# EAGLE schematic minesweeper (EAGLE 7.4.0)
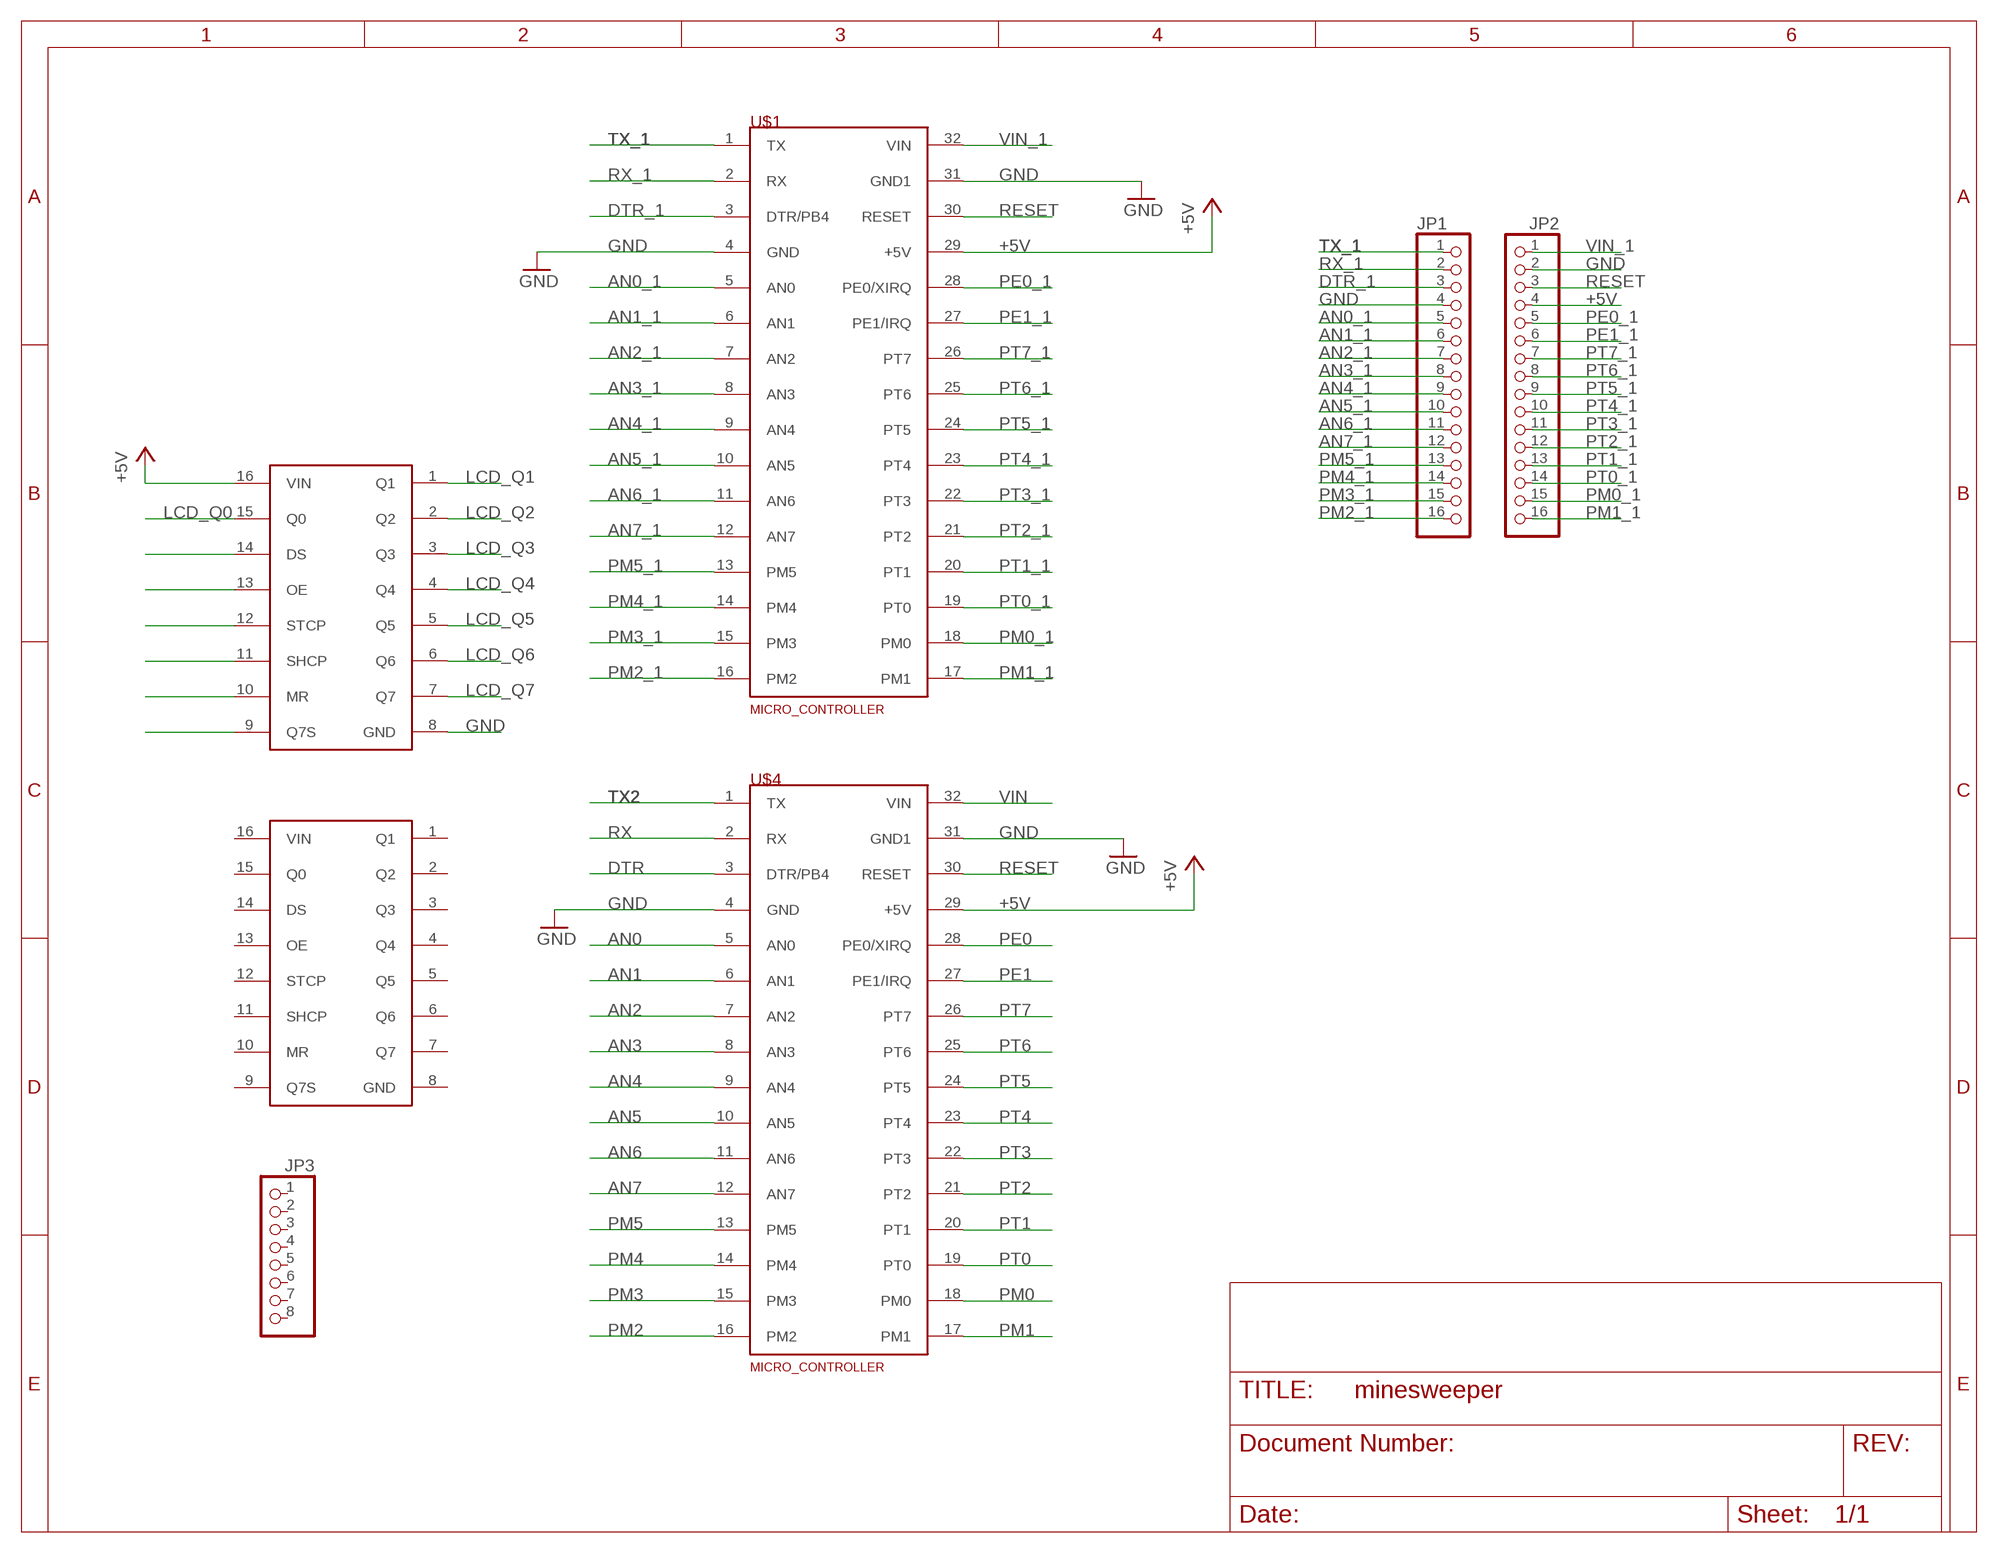
[diagram p0: schematic, sheet 1]

## Parts
JP1  PINHD-1X16  [1X16]
JP2  PINHD-1X16  [1X16]
JP3  PINHD-1X8  [1X08]
U$1  MICRO_CONTROLLER  [MICRO_CONTROLLER]
U$2  SHIFT_REGISTER  [N5]
U$3  SHIFT_REGISTER  [N5]
U$4  MICRO_CONTROLLER  [MICRO_CONTROLLER]

## Nets
+5V: JP2.4 U$1.29(+5V) U$4.29(+5V)
AN0: U$4.5(AN0)
AN0_1: U$1.5(AN0)
AN1: U$4.6(AN1)
AN1_1: U$1.6(AN1)
AN2: U$4.7(AN2)
AN2_1: U$1.7(AN2)
AN3: U$4.8(AN3)
AN3_1: U$1.8(AN3)
AN4: U$4.9(AN4)
AN4_1: U$1.9(AN4)
AN5: U$4.10(AN5)
AN5_1: U$1.10(AN5)
AN6: U$4.11(AN6)
AN6_1: U$1.11(AN6)
AN7: U$4.12(AN7)
AN7_1: U$1.12(AN7)
DTR: U$4.3(DTR/PB4)
DTR_1: U$1.3(DTR/PB4)
GND: JP1.4 JP2.2 U$1.4(GND) U$1.31(GND1) U$3.8(GND) U$4.4(GND) U$4.31(GND1)
LCD_Q1: U$3.1(Q1)
LCD_Q2: U$3.2(Q2)
LCD_Q3: U$3.3(Q3)
LCD_Q4: U$3.4(Q4)
LCD_Q5: U$3.5(Q5)
LCD_Q6: U$3.6(Q6)
LCD_Q7: U$3.7(Q7)
PE0: U$4.28(PE0/XIRQ)
PE0_1: U$1.28(PE0/XIRQ)
PE1: U$4.27(PE1/IRQ)
PE1_1: U$1.27(PE1/IRQ)
PM0: U$4.18(PM0)
PM0_1: U$1.18(PM0)
PM1: U$4.17(PM1)
PM1_1: U$1.17(PM1)
PM2: U$4.16(PM2)
PM2_1: U$1.16(PM2)
PM3: U$4.15(PM3)
PM3_1: U$1.15(PM3)
PM4: U$4.14(PM4)
PM4_1: U$1.14(PM4)
PM5: U$4.13(PM5)
PM5_1: U$1.13(PM5)
PT0: U$4.19(PT0)
PT0_1: U$1.19(PT0)
PT1: U$4.20(PT1)
PT1_1: U$1.20(PT1)
PT2: U$4.21(PT2)
PT2_1: U$1.21(PT2)
PT3: U$4.22(PT3)
PT3_1: U$1.22(PT3)
PT4: U$4.23(PT4)
PT4_1: U$1.23(PT4)
PT5: U$4.24(PT5)
PT5_1: U$1.24(PT5)
PT6: U$4.25(PT6)
PT6_1: U$1.25(PT6)
PT7: U$4.26(PT7)
PT7_1: U$1.26(PT7)
RESET: U$1.30(RESET) U$4.30(RESET)
RX: U$4.2(RX)
RX_1: U$1.2(RX)
TX2: U$4.1(TX)
TX_1: U$1.1(TX)
VIN: U$4.32(VIN)
VIN_1: U$1.32(VIN)
Unconnected: JP1.1 JP1.2 JP1.3 JP1.5 JP1.6 JP1.7 JP1.8 JP1.9 JP1.10 JP1.11 JP1.12 JP1.13 JP1.14 JP1.15 JP1.16 JP2.1 JP2.3 JP2.5 JP2.6 JP2.7 JP2.8 JP2.9 JP2.10 JP2.11 JP2.12 JP2.13 JP2.14 JP2.15 JP2.16 JP3.1 JP3.2 JP3.3 JP3.4 JP3.5 JP3.6 JP3.7 JP3.8 U$2.1(Q1) U$2.2(Q2) U$2.3(Q3) U$2.4(Q4) U$2.5(Q5) U$2.6(Q6) U$2.7(Q7) U$2.8(GND) U$2.9(Q7S) U$2.10(MR) U$2.11(SHCP) U$2.12(STCP) U$2.13(OE) U$2.14(DS) U$2.15(Q0) U$2.16(VIN) U$3.9(Q7S) U$3.10(MR) U$3.11(SHCP) U$3.12(STCP) U$3.13(OE) U$3.14(DS) U$3.15(Q0) U$3.16(VIN)

## Library data of the parts
JP1 JP2 = mini_project_parts:PINHD-1X16: PIN HEADER
JP3 = pinhead:PINHD-1X8: PIN HEADER
U$1 U$4 = mini_project_parts:MICRO_CONTROLLER
U$2 U$3 = mini_project_parts:SHIFT_REGISTER